# EAGLE design ASSIGNMENT (EAGLE 9.6.2)
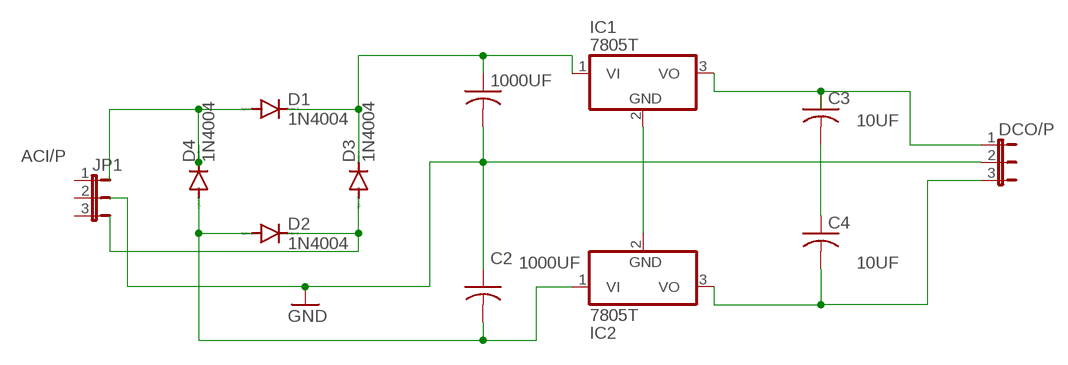
[diagram p0: schematic, sheet 1]

## Parts
1000UF  C-US050-030X075  [C050-030X075]
C2  C-US050-030X075  [C050-030X075]
C3  C-US050-030X075  [C050-030X075]
C4  C-US050-030X075  [C050-030X075]
D1  1N4004  [DO41-10]
D2  1N4004  [DO41-10]
D3  1N4004  [DO41-10]
D4  1N4004  [DO41-10]
DCO/P  JP2E  [JP2]
IC1  7805T  [TO220H]
IC2  7805T  [TO220H]
JP1  JP2E  [JP2]

## Nets
10UF: C3.2 C4.1 C4.2 DCO/P.3 IC2.3(VO)
1000UF: C2.2 D2.A D4.A IC2.1(VI)
ACI/P: D1.A D4.C
GND: 1000UF.2 C2.1 DCO/P.2
N$3: D2.C D3.A
N$7: C3.1 DCO/P.1 IC1.3(VO)
N$8: IC1.2(GND) IC2.2(GND)
N$11: 1000UF.1 D1.C D3.C IC1.1(VI)
Unconnected: JP1.1 JP1.2 JP1.3

## Library data of the parts
1000UF C2-C4 = adafruit:C-US: CAPACITOR, American symbol
D1-D4 = diode:1N4004: DIODE general purpose rectifier, 1 A
DCO/P JP1 = jumper:JP2E: JUMPER
IC1 IC2 = adafruit:78*: Positive VOLTAGE REGULATOR Added bigger pads to the TO-92 package

## Board
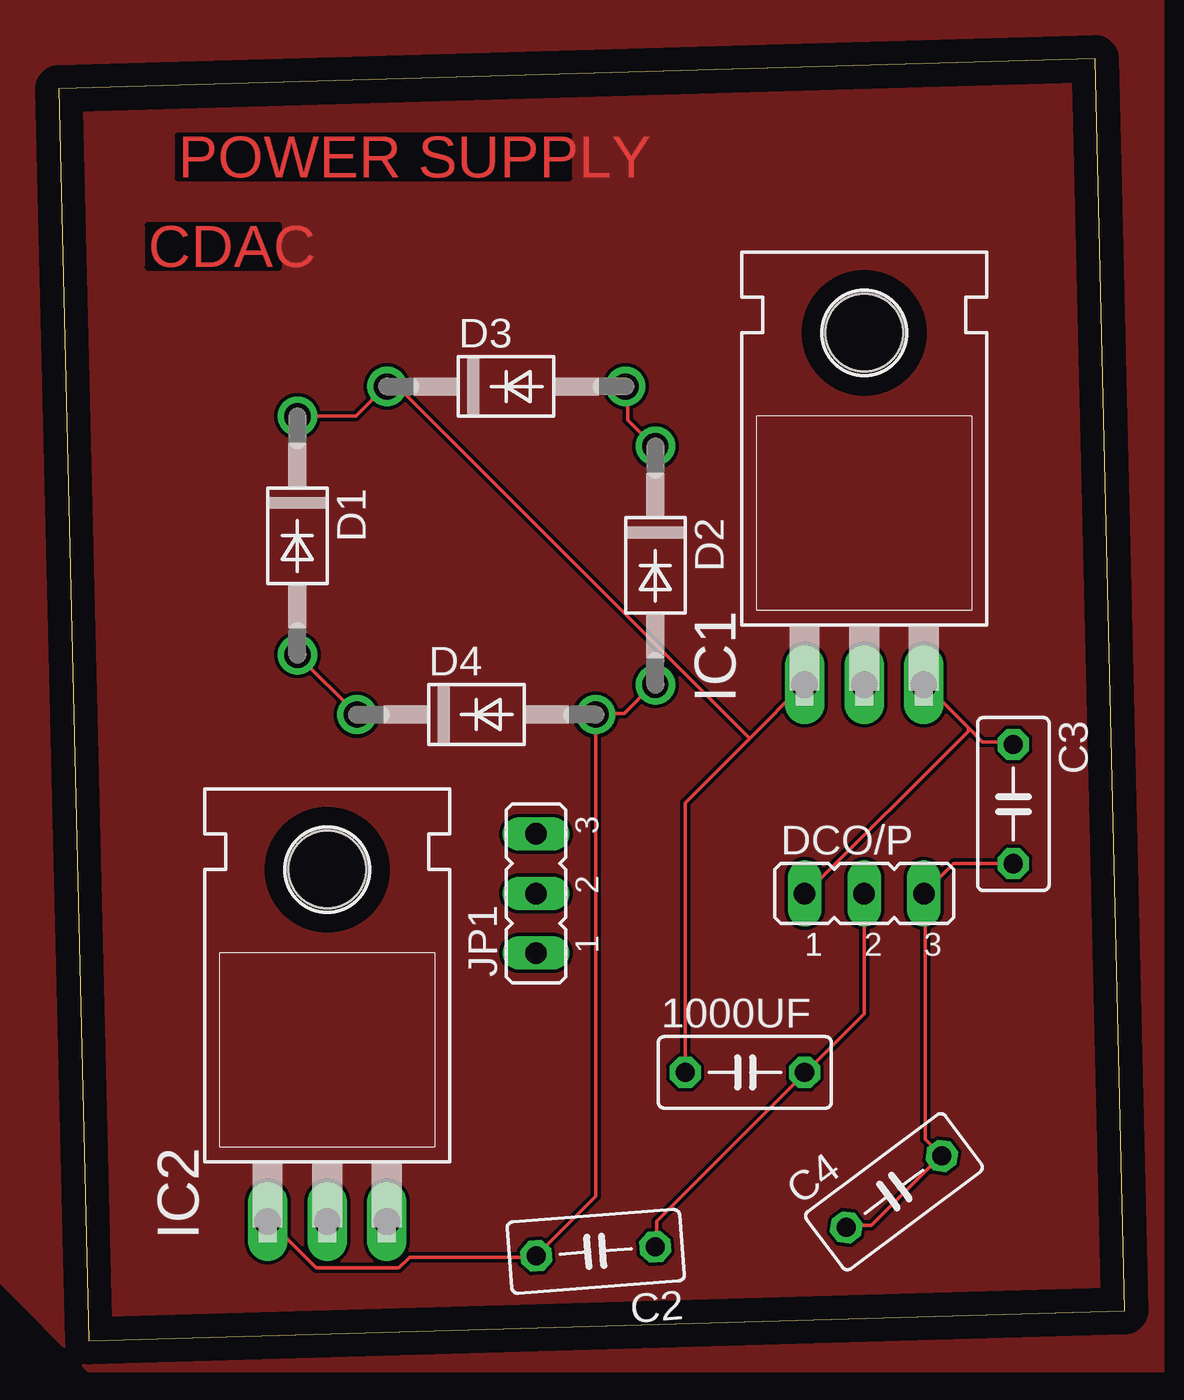
[diagram p1: board, top side]
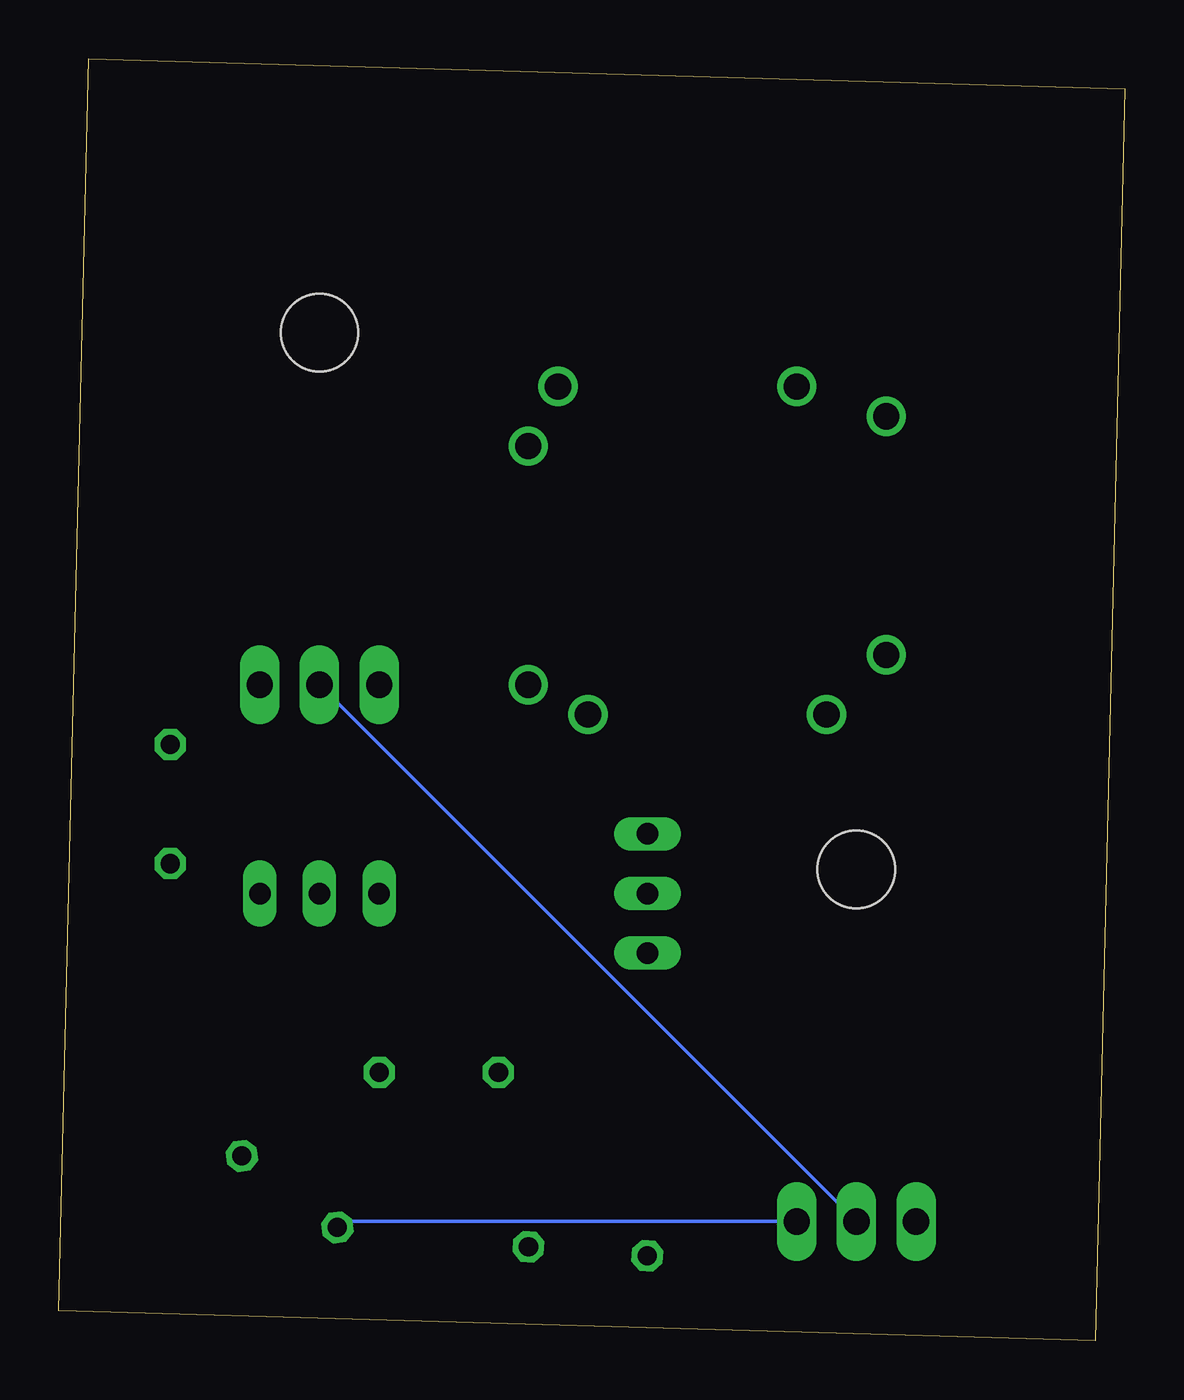
[diagram p2: board, bottom side, seen from below]

Size 45.39 x 54.6 mm. Coordinates in mm from the lower left corner, seen from the top.
Outline: 1.27,0 45.39,1.27 44.12,54.6 0,53.33 1.27,0
Copper layers (1*16): Top 0.035mm / dielectric 1.5mm / Bottom 0.035mm
Design rules "default": minimum track width 6mil, minimum drill 0.35mm, track to track 6mil, track to pad 6mil, pad to pad 6mil, via to via 6mil, smd to smd 6mil, copper to edge 40mil, drill to drill 6mil, minimum pad ring 10mil, minimum via ring 8mil, stop-mask expansion 4mil, vias tented up to drill 0mil, thermal gap 10mil

### Footprints (pad centres in the part's own frame; a part is rotated, then mirrored left to right if it is on the bottom)
C050-030X075 = drill 0.813 octagon: 1 -2.54,0; 2 2.54,0
DO41-10 = drill 1.118: A 5.08,0; C -5.08,0
JP2 = drill 0.914 long: 1 -2.54,0; 2 0,0; 3 2.54,0
TO220H = drill 1.118 long: 1 -2.54,-10.16; 2 0,-10.16; 3 2.54,-10.16 | hole 3.302: 0,4.826

### Placement (x,y rotation side)
1000UF  29.21,11.43 0 top
C2  22.86,3.81 184.4 top
C3  40.64,22.86 270 top
C4  35.56,6.35 36.8 top
D1  10.16,34.29 270 top
D2  25.4,33.02 270 top
D3  19.05,40.64 0 top
D4  17.78,26.67 0 top
DCO/P  34.29,19.05 0 top
IC1  34.29,38.1 0 top
IC2  11.43,15.24 0 top
JP1  20.32,19.05 90 top

### Tracks (layer width: path | path; a pad name or v marks a point on that pad's centre or on a via)
10UF
  Top 0.152: C3.2 38.1,20.32 DCO/P.3 36.88,18.95 36.88,8.59 37.49,7.98 C4.2 37.49,7.82 34.59,4.93 33.53,4.93 C4.1
  Bottom 0.152: IC2.3 33.22,5.08 33.38,4.93 C4.1
1000UF
  Top 0.152: D2.A 25.3,27.94 24.08,26.72 22.86,26.72 D4.A 22.86,6.15 20.42,3.71 C2.2 20.27,3.56 14.94,3.56 14.48,3.1 10.97,3.1 8.99,5.08 IC2.1
ACI/P
  Top 0.152: D1.A D4.C
GND
  Top 0.152: C2.1 25.45,4.01 25.45,5.08 31.7,11.33 1000UF.2 31.85,11.48 34.29,13.92 DCO/P.2
N$3
  Top 0.152: D3.A 24.23,40.59 24.23,39.22 25.3,38.15 D2.C
N$7
  Top 0.152: 38.71,26.11 36.88,27.94 IC1.3 | 38.71,26.11 39.32,25.5 40.54,25.5 C3.1 | 38.71,26.11 38.71,25.96 31.85,19.1 DCO/P.1
N$8
  Bottom 0.152: IC1.2 IC2.2
N$11
  Top 0.152: D1.C 12.65,39.37 13.87,40.59 D3.C 14.02,40.59 14.48,40.59 29.41,25.65 | 1000UF.1 26.67,22.91 29.41,25.65 | 29.41,25.65 31.7,27.94 IC1.1
TL
  pour Top: 1.27,-1.27 46.99,-1.27 46.99,57.15 -2.54,57.15 -2.54,2.54

### Text on the board
Top: POWER SUPPLY | CDAC